# Altium schematic sheet Micro.SchDoc
size A4
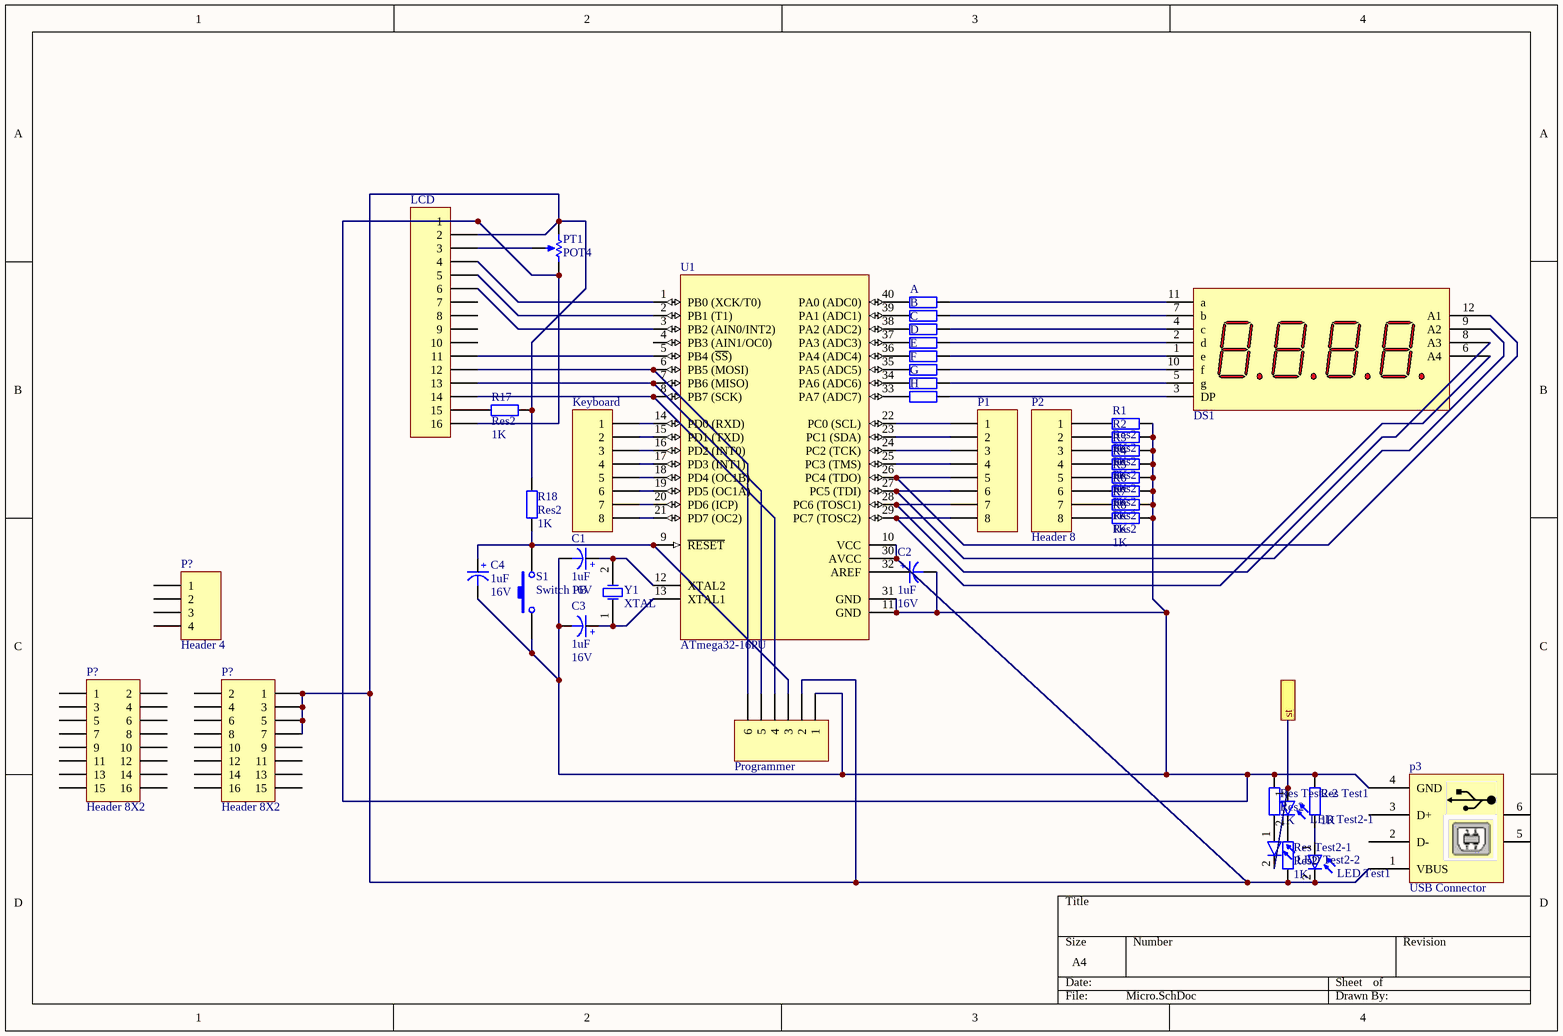
[diagram p0: Micro.SchDoc]

## Parts
(Parts that share a designator on the sheet are numbered #1, #2 ... from top to bottom, then left to right.)
A  (no value)  [AXIAL-0.4]
B  (no value)  [AXIAL-0.4]
C  (no value)  [AXIAL-0.4]
C1  Voltage: 16V  [cap 01]  (hidden comment: 1uF)
C2  Voltage: 16V  [cap 01]  (hidden comment: 1uF)
C3  Voltage: 16V  [cap 01]  (hidden comment: 1uF)
C4  Voltage: 16V  [cap 01]  (hidden comment: 1uF)
D  (no value)  [AXIAL-0.4]
DS1  7Segment-4Digit-CA  [7segCA]  (value not drawn)
E  (no value)  [AXIAL-0.4]
F  (no value)  [AXIAL-0.4]
G  (no value)  [AXIAL-0.4]
H  (no value)  [AXIAL-0.4]
Keyboard  (no value)  [HDR1X8]
LCD  (no value)  [HDR1X16]
LED_Test1  IR Reciever  [LED-5mm-IR Reciver]  (value not drawn)
LED_Test2-1  IR Reciever  [LED-5mm-IR Reciver]  (value not drawn)
LED_Test2-2  IR Reciever  [LED-5mm-IR Reciver]  (value not drawn)
P1  (no value)  [HDR1X8]
P2  Header 8  [HDR1X8]
p3  USB Connector  [USB2.5-2H4F]
P?#1  Header 4  [HDR1X4]
P?#2  Header 8X2  [HDR2X8]
P?#3  Header 8X2  [HDR2X8]
Programmer  (no value)  [HDR1X6]
PT1  POT4  [POT4]
R1  Res2  value 1K  [AXIAL-0.4]
R2  Res2  value 1K  [AXIAL-0.4]
R3  Res2  value 1K  [AXIAL-0.4]
R4  Res2  value 1K  [AXIAL-0.4]
R5  Res2  value 1K  [AXIAL-0.4]
R6  Res2  value 1K  [AXIAL-0.4]
R7  Res2  value 1K  [AXIAL-0.4]
R8  Res2  value 1K  [AXIAL-0.4]
R17  Res2  value 1K  [AXIAL-0.4]
R18  Res2  value 1K  [AXIAL-0.4]
Res_Test1  value 1K  [AXIAL-0.4]
Res_Test2-1  Res2  value 1K  [AXIAL-0.4]
Res_Test2-2  Res2  value 1K  [AXIAL-0.4]
S1  Switch PB  [Switch - Push to On]
U1  ATmega32-16PU  [40P6]
Y1  XTAL  [R38]

## Ports
st

## Nets
st: LED_Test2-1.1(A) LED_Test2-2.2(K) ; port st
NetA_1: A.1 U1.40(PA0_(ADC0))
NetA_2: A.2 DS1.11(a)
NetB_1: B.1 U1.39(PA1_(ADC1))
NetB_2: B.2 DS1.7(b)
NetC1_1: C1.1(+) U1.12(XTAL2) Y1.2(OSC2)
NetC1_2: C1.2(-) C2.2(-) C3.2(-) C4.2(-) LCD.1 LCD.16 p3.4(GND) Programmer.1 PT1.2(BOT) R1.2 R2.2 R3.2 R4.2 R5.2 R6.2 R7.2 R8.2 Res_Test1.1 Res_Test2-2.1 S1.1 U1.11(GND) U1.31(GND)
NetC2_1: C2.1(+) U1.32(AREF)
NetC3_1: C3.1(+) U1.13(XTAL1) Y1.1(OSC1)
NetC4_1: C4.1(+) Programmer.3 R18.1 S1.2 U1.9(~{RESET})
NetC_1: C.1 U1.38(PA2_(ADC2))
NetC_2: C.2 DS1.4(c)
NetD_1: D.1 U1.37(PA3_(ADC3))
NetD_2: D.2 DS1.2(d)
NetDS1_1: DS1.1(e) E.2
NetDS1_3: DS1.3(DP) H.2
NetDS1_5: DS1.5(g) G.2
NetDS1_6: DS1.6(A4) P1.8 U1.29(PC7_(TOSC2))
NetDS1_8: DS1.8(A3) P1.7 U1.28(PC6_(TOSC1))
NetDS1_9: DS1.9(A2) P1.6 U1.27(PC5_(TDI))
NetDS1_10: DS1.10(f) F.2
NetDS1_12: DS1.12(A1) P1.5 U1.26(PC4_(TDO))
NetE_1: E.1 U1.36(PA4_(ADC4))
NetF_1: F.1 U1.35(PA5_(ADC5))
NetG_1: G.1 U1.34(PA6_(ADC6))
NetH_1: H.1 U1.33(PA7_(ADC7))
NetKeyboard_1: Keyboard.1 U1.14(PD0_(RXD))
NetKeyboard_2: Keyboard.2 U1.15(PD1_(TXD))
NetKeyboard_3: Keyboard.3 U1.16(PD2_(INT0))
NetKeyboard_4: Keyboard.4 U1.17(PD3_(INT1))
NetKeyboard_5: Keyboard.5 U1.18(PD4_(OC1B))
NetKeyboard_6: Keyboard.6 U1.19(PD5_(OC1A))
NetKeyboard_7: Keyboard.7 U1.20(PD6_(ICP))
NetKeyboard_8: Keyboard.8 U1.21(PD7_(OC2))
NetLCD_2: LCD.2 LED_Test1.2(K) p3.1(VBUS) P?#3.1 P?#3.3 P?#3.5 P?#3.7 Programmer.2 PT1.1(TOP) R17.2 R18.2 Res_Test2-1.2 U1.10(VCC) U1.30(AVCC)
NetLCD_3: LCD.3 PT1.3(TAP)
NetLCD_4: LCD.4 U1.1(PB0_(XCK/T0))
NetLCD_5: LCD.5 U1.2(PB1_(T1))
NetLCD_6: LCD.6 U1.3(PB2_(AIN0/INT2))
NetLCD_11: LCD.11 U1.5(PB4_(~{SS}))
NetLCD_12: LCD.12 Programmer.6 U1.6(PB5_(MOSI))
NetLCD_13: LCD.13 Programmer.5 U1.7(PB6_(MISO))
NetLCD_14: LCD.14 Programmer.4 U1.8(PB7_(SCK))
NetLCD_15: LCD.15 R17.1
NetLED_Test1_1: LED_Test1.1(A) Res_Test1.2
NetLED_Test2-1_2: LED_Test2-1.2(K) Res_Test2-1.1
NetLED_Test2-2_1: LED_Test2-2.1(A) Res_Test2-2.2
NetP1_1: P1.1 U1.22(PC0_(SCL))
NetP1_2: P1.2 U1.23(PC1_(SDA))
NetP1_3: P1.3 U1.24(PC2_(TCK))
NetP1_4: P1.4 U1.25(PC3_(TMS))
NetP2_1: P2.1 R1.1
NetP2_2: P2.2 R2.1
NetP2_3: P2.3 R3.1
NetP2_4: P2.4 R4.1
NetP2_5: P2.5 R5.1
NetP2_6: P2.6 R6.1
NetP2_7: P2.7 R7.1
NetP2_8: P2.8 R8.1

Not connected (* = marked no-connect by the designer): LCD 7 8 9 10; p3 2(D-) 3(D+) 5 6; P?#1 1 2 3 4; P?#2 1 2 3 4 5 6 7 8 9 10 11 12 13 14 15 16; P?#3 2 4 6 8 9 10 11 12 13 14 15 16; U1 4(PB3_(AIN1/OC0))

## Library data of the parts
A B C D E F G H R1-R8 R17 R18 Res_Test1 Res_Test2-1 Res_Test2-2 = Res2: Resistor; Published: 8-Jun-2000; LatestRevisionDate: 17-Jul-2002; LatestRevisionNote: Re-released for DXP Platform.; PackageReference: AXIAL-0.4; Publisher: Altium Limited; PackageDescription: Axial Device, Thru-Hole; 2 Leads; 0.4 in Pin Spacing
C1-C4 = Cap-Polar: Polar Capacitor; Designer: Saeid Jorablo; Organazation: ControTec; Adding Date: 1387/12/20; Value: 1uF
DS1 = 7Seg-4Digit-CA: 7-Segment Display: CA; Colour: Read; Designer: Seyed Mohsen Ghasemain; Published: 07/31/2012; Publisher: www.picpars.com; ComponentLink1URL: http://www.picpars.com/
Keyboard P1 P2 = Header 8: Header, 8-Pin; LatestRevisionDate: 17-Jul-2002; LatestRevisionNote: Re-released for DXP Platform.; Publisher: Altium Limited
LCD = Header 16: LCD; LatestRevisionDate: 17-Jul-2002; LatestRevisionNote: Re-released for DXP Platform.; Publisher: Altium Limited
LED_Test1 LED_Test2-1 LED_Test2-2 = LED IR Reciever: Infra Red Reciever Photo Diode; Designer: Saeid Jorablo; Organazation: ControTec; Adding Date: 1387/12/22
p3 = USB: USB Connector-B Type; Designer: Eng. Saeid Jorablo; Company: DASE Co; Adding Date: 10/26/2010
P?#1 = Header 4: Header, 4-Pin; LatestRevisionDate: 17-Jul-2002; LatestRevisionNote: Re-released for DXP Platform.; Publisher: Altium Limited
P?#2 P?#3 = Header 8X2: Header, 8-Pin, Dual row; LatestRevisionDate: 17-Jul-2002; LatestRevisionNote: Re-released for DXP Platform.; Publisher: Altium Limited
Programmer = Header 6: Header, 6-Pin; LatestRevisionDate: 17-Jul-2002; LatestRevisionNote: Re-released for DXP Platform.; Publisher: Altium Limited
PT1 = POT4: Variable Potentiometer top adjust; Designer: Seyed Mohsen Ghasemian; WEB: www.picpars.com
S1 = Switch PB: Push Button Switch
U1 = ATmega32-16PU: 8-bit AVR Microcontroller, 4.5-5.5V, 16MHz, 32KB Flash, 1024 Bytes EEPROM, 2KB SRAM, 40-pin PDIP, Industrial Grade (-40°C to 85°C); DatasheetVersion: revQ, Feb-2011; PackageVersion: revB, Sep-2001; PackageReference: 40P6; PackageDescription: 40-lead (0.600"/15.24mm Wide) Plastic Dual Inline Package (PDIP); Code_JEDEC: MS-011-AC; ComponentLink1Description: Manufacturer URL; ComponentLink1URL: http://www.atmel.com/; ComponentLink2Description: ATmega32(L) Datasheet; ComponentLink2URL: http://atmel.com/dyn/resources/prod_documents/doc2503.pdf; ComponentLink3Description: ATmega32(L) Summary; ComponentLink3URL: http://atmel.com/dyn/resources/prod_documents/2503S.pdf
Y1 = XTAL: Crystal Oscillator; Published: 8-Jun-2000; LatestRevisionDate: 17-Jul-2002; LatestRevisionNote: Re-released for DXP Platform.; PackageReference: R38; Publisher: Altium Limited; PackageDescription: Crystal, Thru-Hole; 2 Leads; Body 3.1 x 8.2 mm (Dia.xH)